# EAGLE design MainBoard (EAGLE 9.2.2)

## Sheet 1 of 2
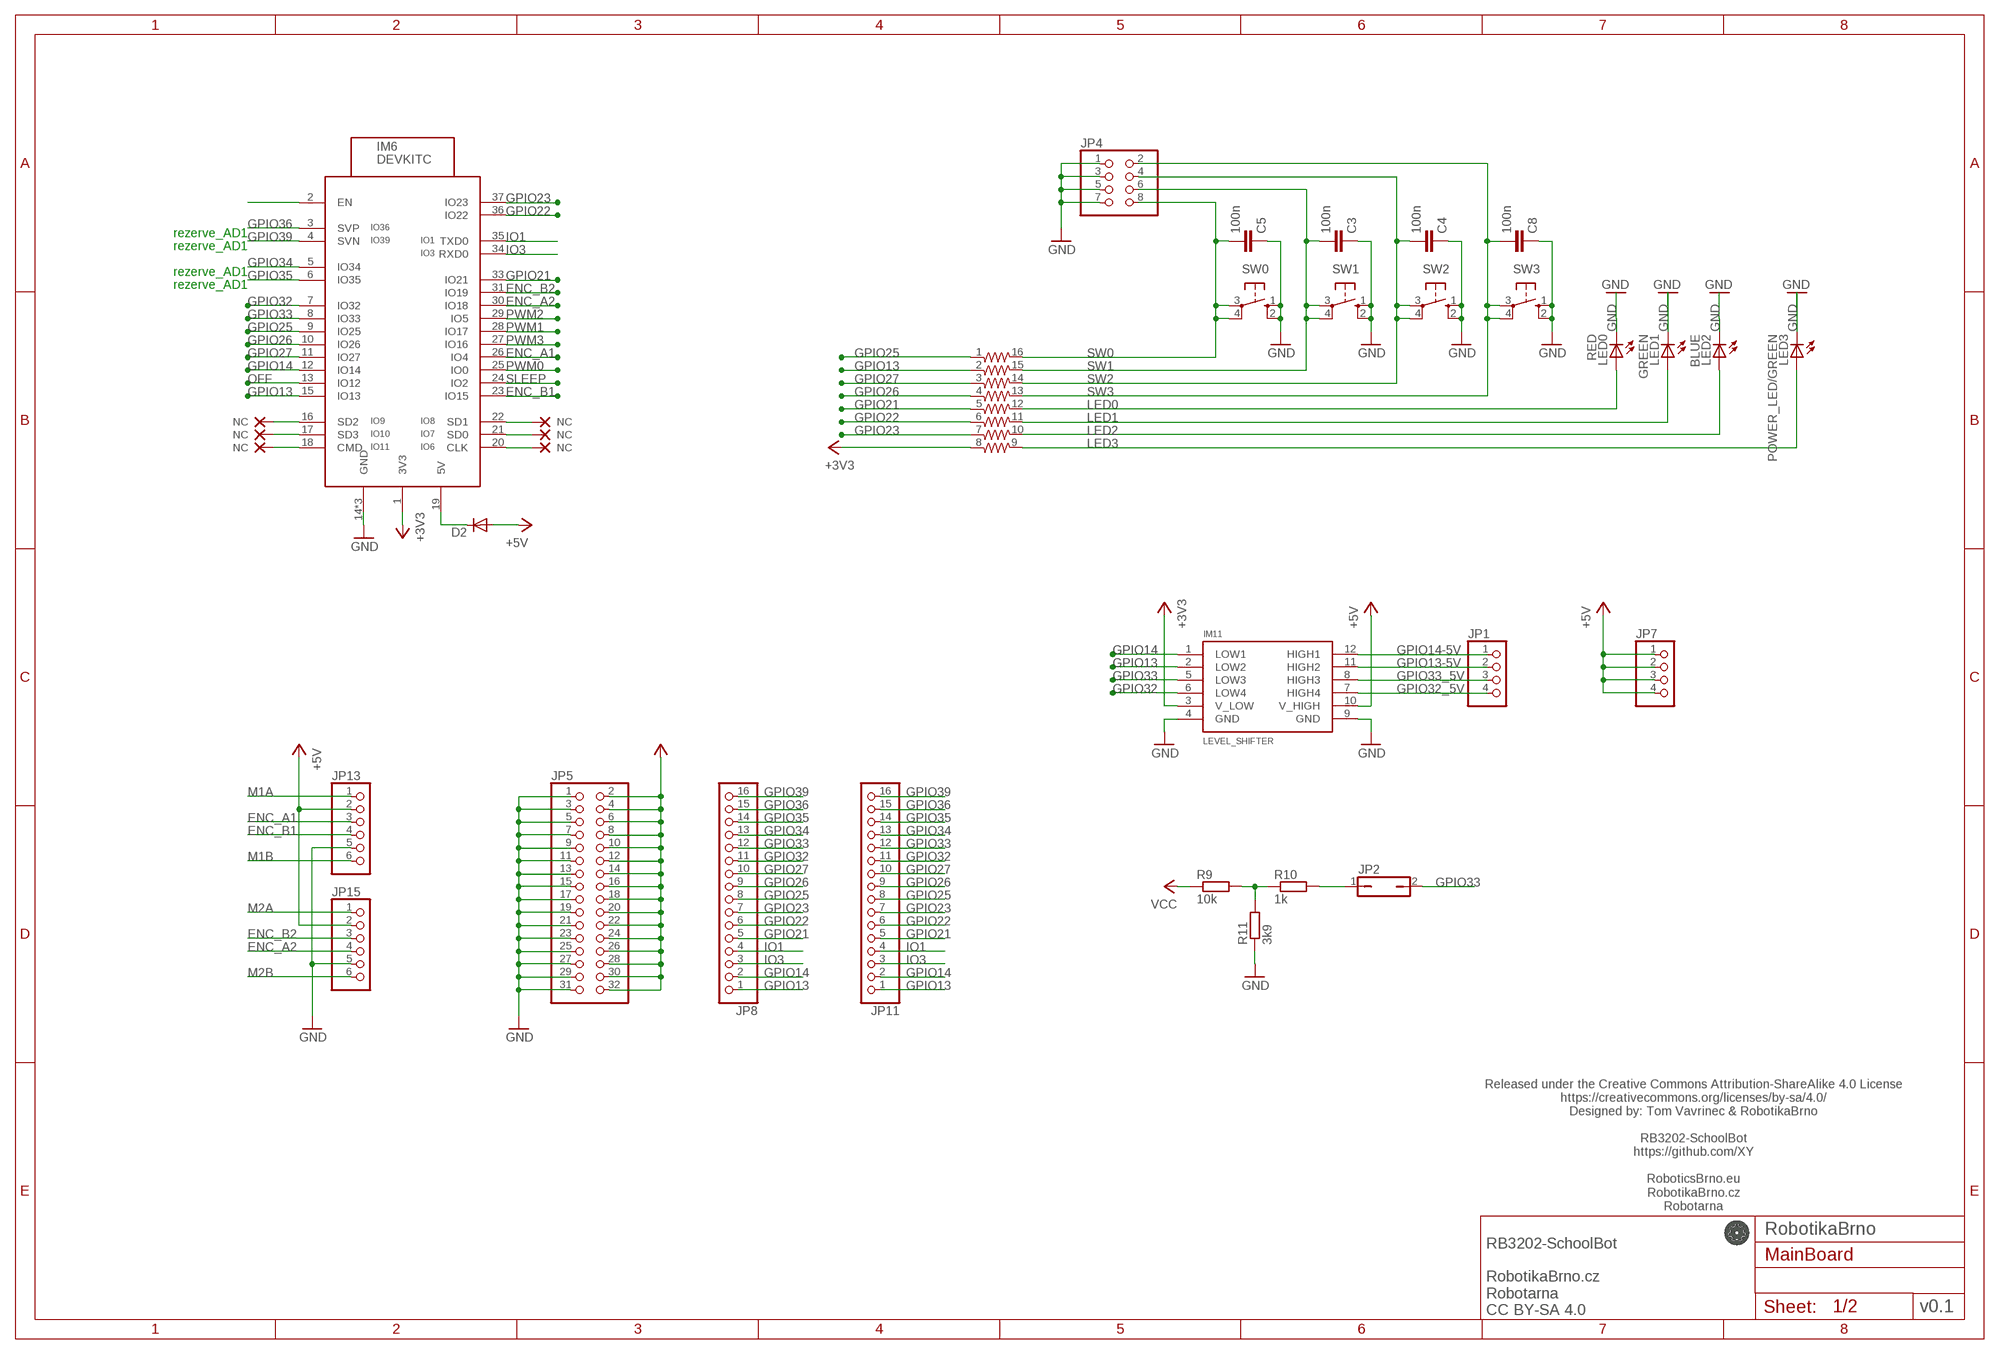
[diagram p0: schematic, sheet 1]

### Parts
C3  100n  C-EUC1206  [C1206]
C4  100n  C-EUC1206  [C1206]
C5  100n  C-EUC1206  [C1206]
C8  100n  C-EUC1206  [C1206]
D2  DIODE-D-7.5  [D-7.5]
IM6  DEVKITC  [DEVKITC]
IM11  LEVEL_SHIFTER  [LEVEL_SHIFTER]
JP1  PINHD-1X4  [1X04]
JP2  JP1Q  [JP1]
JP4  PINHD-2X4  [2X04]
JP5  PINHD-2X16  [2X16]
JP7  PINHD-1X4/90  [1X04/90]
JP8  PINHD-1X16  [1X16]
JP11  PINHD-1X16  [1X16]
JP13  PINHD-1X6  [1X06]
JP15  PINHD-1X6  [1X06]
LED0  RED  LED3MM  [LED3MM]
LED1  GREEN  LED3MM  [LED3MM]
LED2  BLUE  LED3MM  [LED3MM]
LED3  POWER_LED/GREEN  LED3MM  [LED3MM]
NC1  NC  (no package)
NC2  NC  (no package)
NC3  NC  (no package)
NC4  NC  (no package)
NC5  NC  (no package)
NC6  NC  (no package)
R9  10k  R-EU_M0805  [M0805]
R10  1k  R-EU_M0805  [M0805]
R11  3k9  R-EU_M0805  [M0805]
RN1  741-16_SNS  [742-16NS]
SW0  10-XX  [B3F-10XX]
SW1  10-XX  [B3F-10XX]
SW2  10-XX  [B3F-10XX]
SW3  10-XX  [B3F-10XX]

### Nets
+3V3: IM6.1(3V3) IM11.3(V_LOW) JP5.2 JP5.4 JP5.6 JP5.8 JP5.10 JP5.12 JP5.14 JP5.16 JP5.18 JP5.20 JP5.22 JP5.24 JP5.26 JP5.28 JP5.30 JP5.32 RN1.8 ; also sheet 2
+5V: D2.A IM11.10(V_HIGH) JP7.1 JP7.2 JP7.3 JP7.4 JP13.2 JP15.2 ; also sheet 2
+5V_ESP: D2.C IM6.19(5V)
ENC_A1: IM6.26(IO4) JP13.3
ENC_A2: IM6.30(IO18) JP15.4
ENC_B1: IM6.23(IO15) JP13.4
ENC_B2: IM6.31(IO19) JP15.3
GND: C3.1 C4.1 C5.1 C8.1 IM6.14(GND) IM6.32(GND) IM6.38(GND) IM11.4(GND) IM11.9(GND) JP4.1 JP4.3 JP4.5 JP4.7 JP5.1 JP5.3 JP5.5 JP5.7 JP5.9 JP5.11 JP5.13 JP5.15 JP5.17 JP5.19 JP5.21 JP5.23 JP5.25 JP5.27 JP5.29 JP5.31 JP13.5 JP15.5 LED0.K(C) LED1.K(C) LED2.K(C) LED3.K(C) R11.1 SW0.1(S) SW0.2(S1) SW1.1(S) SW1.2(S1) SW2.1(S) SW2.2(S1) SW3.1(S) SW3.2(S1) ; also sheet 2
GPIO13: IM6.15(IO13) IM11.2(LOW2) JP8.1 JP11.1 RN1.2
GPIO13-5V: IM11.11(HIGH2) JP1.2
GPIO14: IM6.12(IO14) IM11.1(LOW1) JP8.2 JP11.2
GPIO14-5V: IM11.12(HIGH1) JP1.1 ; also sheet 2
GPIO21: IM6.33(IO21) JP8.5 JP11.5 RN1.5
GPIO22: IM6.36(IO22) JP8.6 JP11.6 RN1.6
GPIO23: IM6.37(IO23) JP8.7 JP11.7 RN1.7 ; also sheet 2
GPIO25: IM6.9(IO25) JP8.8 JP11.8 RN1.1
GPIO26: IM6.10(IO26) JP8.9 JP11.9 RN1.4
GPIO27: IM6.11(IO27) JP8.10 JP11.10 RN1.3
GPIO32: IM6.7(IO32) IM11.6(LOW4) JP8.11 JP11.11
GPIO32_5V: IM11.7(HIGH4) JP1.4
GPIO33: IM6.8(IO33) IM11.5(LOW3) JP2.2 JP8.12 JP11.12
GPIO33_5V: IM11.8(HIGH3) JP1.3
GPIO34: IM6.5(IO34) JP8.13 JP11.13
GPIO35: IM6.6(IO35) JP8.14 JP11.14
GPIO36: IM6.3(SVP) JP8.15 JP11.15
GPIO39: IM6.4(SVN) JP8.16 JP11.16
IO1: IM6.35(TXD0) JP8.4 JP11.4
IO3: IM6.34(RXD0) JP8.3 JP11.3
IO9_NC: IM6.16(SD2) NC1.NC
IO9_NC1: IM6.20(CLK) NC4.NC
IO10_NC: IM6.17(SD3) NC2.NC
IO10_NC1: IM6.21(SD0) NC5.NC
IO11_NC: IM6.18(CMD) NC3.NC
IO11_NC1: IM6.22(SD1) NC6.NC
LED0: LED0.A RN1.12
LED1: LED1.A RN1.11
LED2: LED2.A RN1.10
LED3: LED3.A RN1.9
M1A: JP13.1 ; also sheet 2
M1B: JP13.6 ; also sheet 2
M2A: JP15.1 ; also sheet 2
M2B: JP15.6 ; also sheet 2
N$2: JP2.1 R10.2
N$4: R9.2 R10.1 R11.2
N$6: IM6.2(EN)
OFF: IM6.13(IO12) ; also sheet 2
PWM0: IM6.25(IO0) ; also sheet 2
PWM1: IM6.28(IO17) ; also sheet 2
PWM2: IM6.29(IO5) ; also sheet 2
PWM3: IM6.27(IO16) ; also sheet 2
SLEEP: IM6.24(IO2) ; also sheet 2
SW0: C5.2 JP4.8 RN1.16 SW0.3(P) SW0.4(P1)
SW1: C3.2 JP4.6 RN1.15 SW1.3(P) SW1.4(P1)
SW2: C4.2 JP4.4 RN1.14 SW2.3(P) SW2.4(P1)
SW3: C8.2 JP4.2 RN1.13 SW3.3(P) SW3.4(P1)
VCC: R9.1 ; also sheet 2

### Notes on the sheet
- rezerve_AD1
- rezerve_AD1
- rezerve_AD1
- rezerve_AD1
- Released under the Creative Commons Attribution-ShareAlike 4.0 License
  https://creativecommons.org/licenses/by-sa/4.0/
  Designed by: Tom Vavrinec & RobotikaBrno
  
  RB3202-SchoolBot
  https://github.com/XY
  
  RoboticsBrno.eu
  RobotikaBrno.cz
  Robotarna
- RobotikaBrno
- v0.1
- RB3202-SchoolBot
  
  RobotikaBrno.cz
  Robotarna
  CC BY-SA 4.0

## Sheet 2 of 2
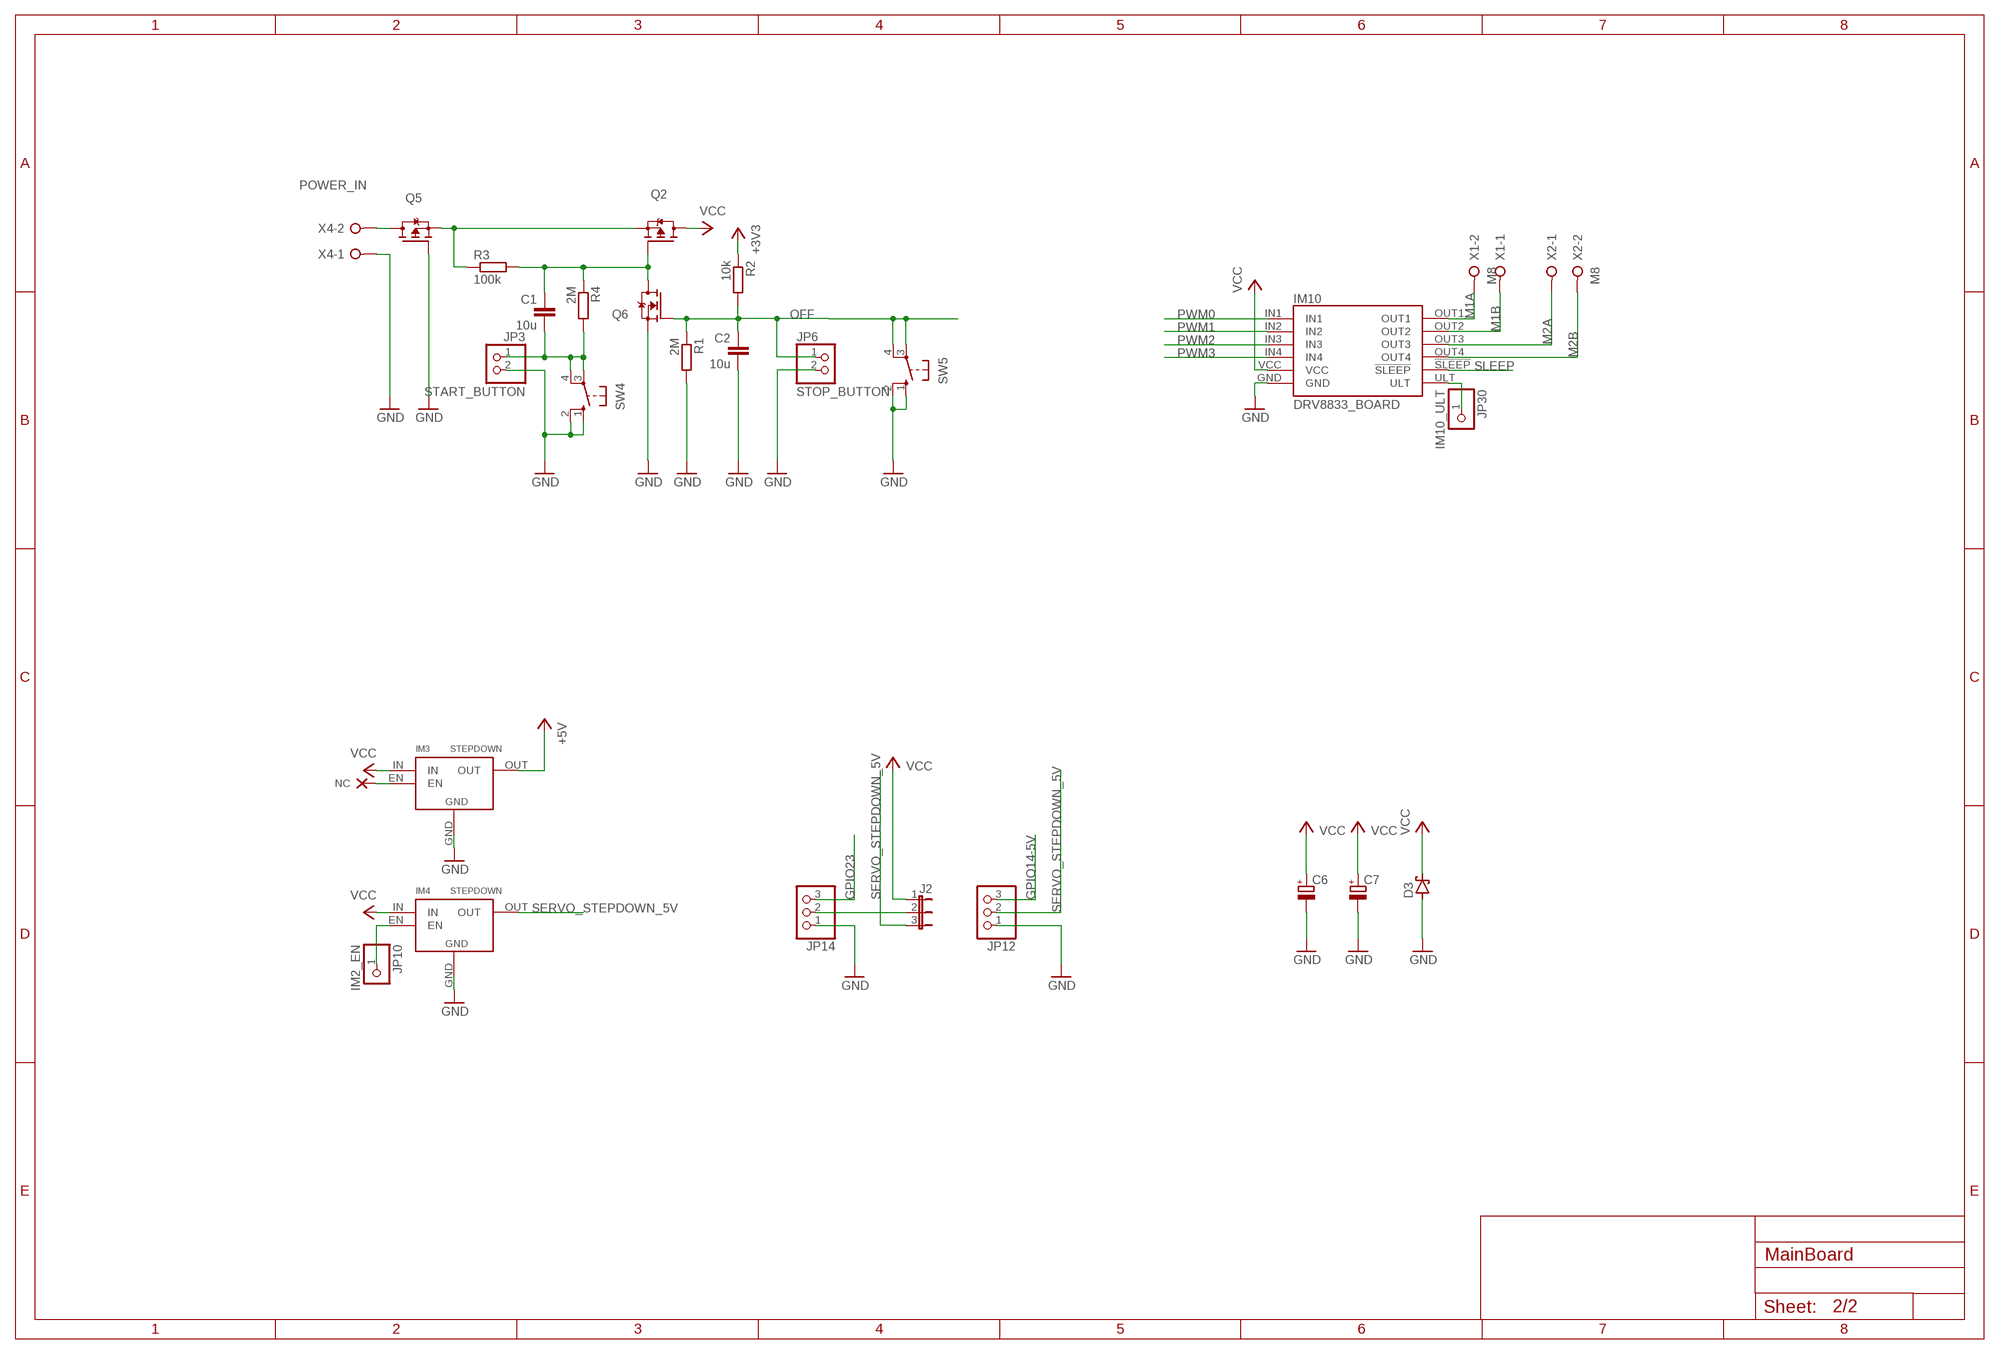
[diagram p1: schematic, sheet 2]

### Parts
C1  10u  C-EUC1206  [C1206]
C2  10u  C-EUC1206  [C1206]
C6  CPOL-EUE5-10.5  [E5-10,5]
C7  CPOL-EUE5-10.5  [E5-10,5]
D3  SCHOTTKY-DIODEF126Z12  [F126Z12]
IM3  STEPDOWN  [STEPDOWN]
IM4  STEPDOWN  [STEPDOWN]
IM10  DRV8833_BOARD  [PINHEAD]
J2  JP2E  [JP2]
JP3  START_BUTTON  PINHD-1X2  [1X02]
JP6  STOP_BUTTON  PINHD-1X2  [1X02]
JP10  IM2_EN  PINHD-1X1  [1X01]
JP12  PINHD-1X3  [1X03]
JP14  PINHD-1X3  [1X03]
JP30  IM10_ULT  PINHD-1X1  [1X01]
NC7  NC  (no package)
Q2  P-MOSFET-TO220V  [TO220V]
Q5  P-MOSFET-TO220V  [TO220V]
Q6  N-MOSFET-SOT23-GSD  [SOT23]
R1  2M  R-EU_R0805  [R0805]
R2  10k  R-EU_0204/2V  [0204V]
R3  100k  R-EU_R0805  [R0805]
R4  2M  R-EU_M0805  [M0805]
SW4  10-XX  [B3F-10XX]
SW5  10-XX  [B3F-10XX]
X1  M8  W237-02P  [W237-132]
X2  M8  W237-02P  [W237-132]
X4  POWER_IN  W237-02P  [W237-132]

### Nets
+3V3: R2.1 ; also sheet 1
+5V: IM3.OUT ; also sheet 1
BAT1: Q5.2(D) X4.2
BAT_PROT1: Q2.3(S) Q5.3(S) R3.1
GND: C2.2 C6.- C7.- D3.A IM3.GND IM4.GND IM10.GND JP3.2 JP6.2 JP12.1 JP14.1 Q5.1(G) Q6.2(S) R1.2 SW4.1(S) SW4.2(S1) SW5.1(S) SW5.2(S1) X4.1 ; also sheet 1
GPIO14-5V: JP12.3 ; also sheet 1
GPIO23: JP14.3 ; also sheet 1
IO9_NC2: IM3.EN NC7.NC
M1A: IM10.OUT1 X1.2 ; also sheet 1
M1B: IM10.OUT2 X1.1 ; also sheet 1
M2A: IM10.OUT3 X2.1 ; also sheet 1
M2B: IM10.OUT4 X2.2 ; also sheet 1
N$1: IM10.ULT JP30.1
N$3: J2.2 JP14.2
OFF: C2.1 JP6.1 Q6.1(G) R1.1 R2.2 SW5.3(P) SW5.4(P1) ; also sheet 1
PWM0: IM10.IN1 ; also sheet 1
PWM1: IM10.IN2 ; also sheet 1
PWM2: IM10.IN3 ; also sheet 1
PWM3: IM10.IN4 ; also sheet 1
SERVO_STEPDOWN_5V: IM4.OUT J2.3 JP12.2
SLEEP: IM10.!SLEEP ; also sheet 1
START_BUTTON1: C1.2 JP3.1 R4.2 SW4.3(P) SW4.4(P1)
START_GATE1: C1.1 Q2.1(G) Q6.3(D) R3.2 R4.1
STEP2_EN1: IM4.EN JP10.1
VCC: C6.+ C7.+ D3.C IM3.IN IM4.IN IM10.VCC J2.1 Q2.2(D) ; also sheet 1

## Library data of the parts
C1-C5 C8 = rcl_upravena:C-EU: CAPACITOR, European symbol
C6 C7 = rcl:CPOL-EU: POLARIZED CAPACITOR, European symbol; SPICEPREFIX: C
D2 = diode:DIODE-: DIODE
D3 = diode:SCHOTTKY-DIODE: Schottky Diode
IM3 IM4 = StepDown:STEPDOWN
IM6 = esp32:DEVKITC
IM10 = DRV8833board:DRV8833_BOARD
IM11 = LevelShifter:LEVEL_SHIFTER
J2 = jumper:JP2E: JUMPER
JP1 JP7 = pinhead:PINHD-1X4: PIN HEADER
JP2 = jumper:JP1Q: JUMPER
JP3 JP6 = pinhead:PINHD-1X2: PIN HEADER
JP4 = pinhead:PINHD-2X4: PIN HEADER
JP5 = pinhead:PINHD-2X16: PIN HEADER
JP8 JP11 = pinhead:PINHD-1X16: PIN HEADER
JP10 JP30 = pinhead:PINHD-1X1: PIN HEADER
JP12 JP14 = pinhead:PINHD-1X3: PIN HEADER
JP13 JP15 = pinhead:PINHD-1X6: PIN HEADER
LED0 LED1-LED3 = led:LED: LED OSRAM: - CHIPLED LG R971, LG N971, LY N971, LG Q971, LY Q971, LO R971, LY R971 LH N974, LH R974 LS Q976, LO Q976, LY Q976 LO Q996 - Hyper CHIPLED LW Q18S LB Q993, LB Q99A, LB R99A - SideLED LS A670, LO A670, LY A670, LG A670, LP A670 LB A673, LV A673, LT A673, LW A673 LH A674 LY A675 LS A676, LA A676, LO A676, LY A676, LW A676 LS A679, LY A679, LG A679 - Hyper Micro SIDELED® LS Y876, LA Y876, LO Y876, LY Y876 LT Y87S - SmartLED LW L88C, LW L88S LB L89C, LB L89S, LG L890 LS L89K, LO L89K, LY L89K LS L896, LA L896, LO L896, LY L896 - TOPLED LS T670, LO T670, LY T670, LG T670, LP T670 LSG T670, LSP T670, LSY T670, LOP T670, LYG T670 LG T671, LOG T671, LSG T671 LB T673, LV T673, LT T673, LW T673 LH T674 LS T676, LA T676, LO T676, LY T676, LB T676, LH T676, LSB T676, LW T676 LB T67C, LV T67C, LT T67C, LS T67K, LO T67K, LY T67K, LW E67C LS E67B, LA E67B, LO E67B, LY E67B, LB E67C, LV E67C, LT E67C LW T67C LS T679, LY T679, LG T679 LS T770, LO T770, LY T770, LG T770, LP T770 LB T773, LV T773, LT T773, LW T773 LH T774 LS E675, LA E675, LY E675, LS T675 LS T776, LA T776, LO T776, LY T776, LB T776 LHGB T686 LT T68C, LB T68C - Hyper Mini TOPLED® LB M676 - Mini TOPLED Santana® LG M470 LS M47K, LO M47K, LY M47K Source: http://www.osram.convergy.de LUXEON: - LUMILED® LXK2-PW12-R00, LXK2-PW12-S00, LXK2-PW14-U00, LXK2-PW14-V00 LXK2-PM12-R00, LXK2-PM12-S00, LXK2-PM14-U00 LXK2-PE12-Q00, LXK2-PE12-R00, LXK2-PE12-S00, LXK2-PE14-T00, LXK2-PE14-U00 LXK2-PB12-K00, LXK2-PB12-L00, LXK2-PB12-M00, LXK2-PB14-N00, LXK2-PB14-P00, LXK2-PB14-Q00 LXK2-PR12-L00, LXK2-PR12-M00, LXK2-PR14-Q00, LXK2-PR14-R00 LXK2-PD12-Q00, LXK2-PD12-R00, LXK2-PD12-S00 LXK2-PH12-R00, LXK2-PH12-S00 LXK2-PL12-P00, LXK2-PL12-Q00, LXK2-PL12-R00 Source: www.luxeon.com KINGBRIGHT: KA-3528ASYC Source: www.kingbright.com
NC1-NC7 = NC:NC: _EXTERNAL_
Q2 Q5 = transistors:P-MOSFET
Q6 = transistors:N-MOSFET
R1-R4 = rcl_upravena:R-EU_: RESISTOR, European symbol
R9-R11 = resistor:R-EU_: RESISTOR, European symbol
RN1 = resistor-array:741-16_S: CTS 741 Series 16 Terminations, 8 Resistors
SW0 SW1-SW5 = switch-omron:10-XX: OMRON SWITCH; MPN: B3F-1000; OC_FARNELL: 176432; OC_NEWARK: 36M3542
X1 X2 X4 = con-wago-508:W237-02P: WAGO SREW CLAMP; OC_FARNELL: unknown; OC_NEWARK: unknown

## Net classes
0 default: width 0.2 mm, drill 0.35 mm, clearance 0.2 mm

## Board
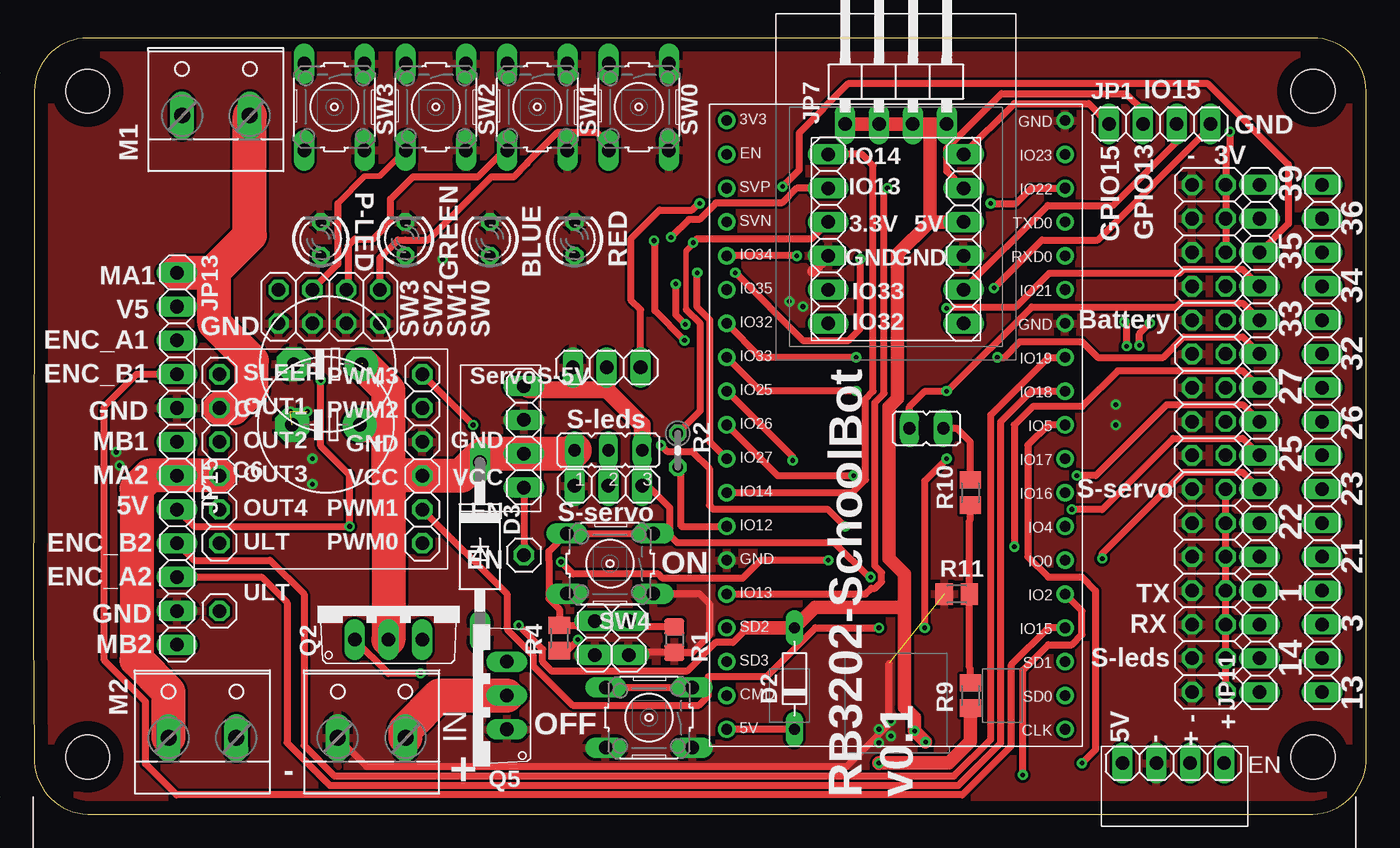
[diagram p2: board, top side]
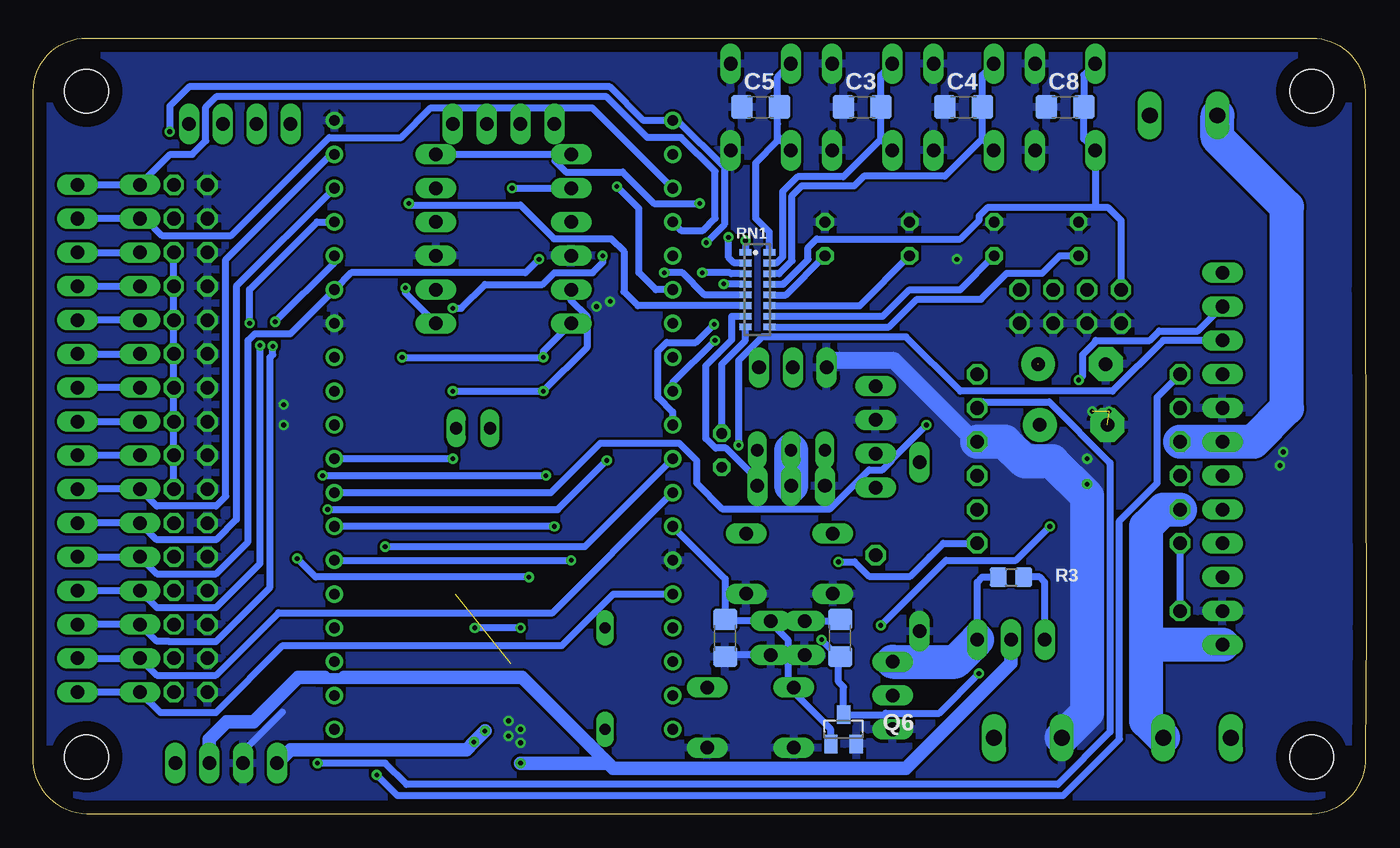
[diagram p3: board, bottom side, seen from below]

Size 100.08 x 58.3 mm. Coordinates in mm from the lower left corner, seen from the top.
Outline: 4.08,58.3 arc90 0.08,54.3 0.08,39.4 0,14 0.08,4.3 arc90 4.08,0 96.08,0 arc90 100.08,4.3 100.08,54.3 arc90 96.08,58.3 4.08,58.3
Copper layers (1*16): Top 0.035mm / dielectric 1.5mm / Bottom 0.035mm
Design rules "gatema_2layers *": minimum track width 6mil, minimum drill 0.35mm, track to track 6mil, track to pad 6mil, pad to pad 6mil, via to via 6mil, smd to smd 6mil, copper to edge 40mil, drill to drill 6mil, minimum pad ring 10mil, minimum via ring 8mil, stop-mask expansion 4mil, vias tented up to drill 0mil, thermal gap 10mil
Holes 3.3 mm at 4.08,54.3 4.08,4.3 96.08,4.3 96.08,54.3
tRestrict: area 93.6,1.8 to 98.6,6.8; area 1.6,1.8 to 6.6,6.8; area 1.6,51.8 to 6.6,56.8; area 93.6,51.8 to 98.6,56.8

### Footprints (pad centres in the part's own frame; a part is rotated, then mirrored left to right if it is on the bottom)
C1206 = smd 1.6 x 1.8: 1 -1.4,0; 2 1.4,0
E5-10,5 = drill 1.016 pad 2.54: + -2.54,0 | drill 1.016 pad 2.54 octagon: - 2.54,0
D-7.5 = drill 0.813 long: A 3.81,0; C -3.81,0
F126Z12 = drill 1.016 long: A 6.35,0; C -6.35,0
STEPDOWN = drill 1.016 long: EN 1.27,8.89; GND 1.27,3.81; IN 1.27,6.35; OUT 1.27,1.27
DEVKITC = drill 0.8: 1 -12.7,46.99; 2 -12.7,44.45; 3 -12.7,41.91; 4 -12.7,39.37; 5 -12.7,36.83; 6 -12.7,34.29; 7 -12.7,31.75; 8 -12.7,29.21; 9 -12.7,26.67; 10 -12.7,24.13; 11 -12.7,21.59; 12 -12.7,19.05; 13 -12.7,16.51; 14 -12.7,13.97; 15 -12.7,11.43; 16 -12.7,8.89; 17 -12.7,6.35; 18 -12.7,3.81; 19 -12.7,1.27; 20 12.7,1.27; 21 12.7,3.81; 22 12.7,6.35; 23 12.7,8.89; 24 12.7,11.43; 25 12.7,13.97; 26 12.7,16.51; 27 12.7,19.05; 28 12.7,21.59; 29 12.7,24.13; 30 12.7,26.67; 31 12.7,29.21; 32 12.7,31.75; 33 12.7,34.29; 34 12.7,36.83; 35 12.7,39.37; 36 12.7,41.91; 37 12.7,44.45; 38 12.7,46.99
PINHEAD = drill 1.016 octagon: !SLEEP 1.27,13.97; GND 16.51,8.89; IN1 16.51,1.27; IN2 16.51,3.81; IN3 16.51,11.43; IN4 16.51,13.97; OUT1 1.27,11.43; OUT2 1.27,8.89; OUT3 1.27,6.35; OUT4 1.27,3.81; ULT 1.27,1.27; VCC 16.51,6.35
LEVEL_SHIFTER = drill 1.016 long: 1 1.27,1.27; 2 3.81,1.27; 3 6.35,1.27; 4 8.89,1.27; 5 11.43,1.27; 6 13.97,1.27; 7 13.97,11.43; 8 11.43,11.43; 9 8.89,11.43; 10 6.35,11.43; 11 3.81,11.43; 12 1.27,11.43
JP2 = drill 0.914 long: 1 -2.54,0; 2 0,0; 3 2.54,0
1X04 = drill 1.016 long: 1 -3.81,0; 2 -1.27,0; 3 1.27,0; 4 3.81,0
JP1 = drill 0.914 long: 1 0,-1.27; 2 0,1.27
1X02 = drill 1.016 long: 1 -1.27,0; 2 1.27,0
2X04 = drill 1.016 octagon: 1 -3.81,-1.27; 2 -3.81,1.27; 3 -1.27,-1.27; 4 -1.27,1.27; 5 1.27,-1.27; 6 1.27,1.27; 7 3.81,-1.27; 8 3.81,1.27
2X16 = drill 1.016 octagon: 1 -19.05,-1.27; 2 -19.05,1.27; 3 -16.51,-1.27; 4 -16.51,1.27; 5 -13.97,-1.27; 6 -13.97,1.27; 7 -11.43,-1.27; 8 -11.43,1.27; 9 -8.89,-1.27; 10 -8.89,1.27; 11 -6.35,-1.27; 12 -6.35,1.27; 13 -3.81,-1.27; 14 -3.81,1.27; 15 -1.27,-1.27; 16 -1.27,1.27; 17 1.27,-1.27; 18 1.27,1.27; 19 3.81,-1.27; 20 3.81,1.27; 21 6.35,-1.27; 22 6.35,1.27; 23 8.89,-1.27; 24 8.89,1.27; 25 11.43,-1.27; 26 11.43,1.27; 27 13.97,-1.27; 28 13.97,1.27; 29 16.51,-1.27; 30 16.51,1.27; 31 19.05,-1.27; 32 19.05,1.27
1X04/90 = drill 1.016 long: 1 -3.81,-3.81; 2 -1.27,-3.81; 3 1.27,-3.81; 4 3.81,-3.81
1X16 = drill 1.016 long: 1 -19.05,0; 2 -16.51,0; 3 -13.97,0; 4 -11.43,0; 5 -8.89,0; 6 -6.35,0; 7 -3.81,0; 8 -1.27,0; 9 1.27,0; 10 3.81,0; 11 6.35,0; 12 8.89,0; 13 11.43,0; 14 13.97,0; 15 16.51,0; 16 19.05,0
1X01 = drill 1.016 octagon: 1 0,0
1X03 = drill 1.016 long: 1 -2.54,0; 2 0,0; 3 2.54,0
1X06 = drill 1.016 long: 1 -6.35,0; 2 -3.81,0; 3 -1.27,0; 4 1.27,0; 5 3.81,0; 6 6.35,0
LED3MM = drill 0.813 octagon: A -1.27,0; K 1.27,0
TO220V = drill 1.016 long: 1 -2.54,-2.54; 2 0,-2.54; 3 2.54,-2.54
SOT23 = smd 1 x 1.4: 1 -0.95,-1.1; 2 0.95,-1.1; 3 0,1.1
R0805 = smd 1.3 x 1.5: 1 -0.95,0; 2 0.95,0
0204V = drill 0.813 octagon: 1 -1.27,0; 2 1.27,0
M0805 = smd 1.3 x 1.6: 1 -0.95,0; 2 0.95,0
742-16NS = smd 0.5 x 0.9: 1 -2.8,-0.9; 2 -2,-0.9; 3 -1.2,-0.9; 4 -0.4,-0.9; 5 0.4,-0.9; 6 1.2,-0.9; 7 2,-0.9; 8 2.8,-0.9; 9 2.8,0.9; 10 2,0.9; 11 1.2,0.9; 12 0.4,0.9; 13 -0.4,0.9; 14 -1.2,0.9; 15 -2,0.9; 16 -2.8,0.9
B3F-10XX = drill 1.016 long: 1 -3.251,2.261; 2 3.251,2.261; 3 -3.251,-2.261; 4 3.251,-2.261
W237-132 = drill 1.194 long: 1 -2.54,-0.635; 2 2.54,-0.635

### Placement (x,y rotation side)
C1  39.5,13.24 90 bottom
C2  48.13,13.24 270 bottom
C3  37.85,53.12 0 bottom
C4  30.23,53.12 0 bottom
C5  45.47,53.12 0 bottom
C6  21.97,29.24 180 top
C7  22.1,33.81 180 top
C8  22.61,53.12 0 bottom
D2  57.15,10.19 90 top
D3  33.53,20.1 270 top
IM3  80.52,5.11 270 top
IM4  38.1,33.43 180 top
IM6  64.77,5.11 0 top
IM10  12.7,19.08 0 top
IM11  58.42,50.83 270 top
J2  43.18,27.34 0 top
JP1  84.58,51.85 0 top
JP2  67.06,28.99 90 top
JP3  42.16,13.24 270 top
JP4  22.23,38.13 0 top
JP5  88.27,28.22 270 top
JP6  44.7,13.24 270 top
JP7  64.77,55.66 0 top
JP8  96.77,28.22 90 top
JP10  36.83,19.46 0 top
JP11  92.08,28.22 90 top
JP12  43.05,33.56 0 top
JP13  10.79,34.32 270 top
JP14  43.18,24.67 0 top
JP15  10.79,19.08 270 top
JP30  13.97,15.27 0 top
LED0  40.64,43.21 90 top
LED1  34.29,43.21 90 top
LED2  27.94,43.21 90 top
LED3  21.59,43.21 90 top
Q2  26.67,15.65 0 top
Q5  33.02,8.92 90 top
Q6  39.24,6.38 0 bottom
R1  48.13,13.11 270 top
R2  48.39,27.34 270 top
R3  26.67,17.81 0 bottom
R4  39.5,13.24 90 top
R9  70.36,8.92 90 top
R10  70.36,24.16 90 top
R11  69.34,16.54 0 top
RN1  45.72,39.4 270 bottom
SW0  45.47,53.12 270 top
SW1  37.85,53.12 270 top
SW2  30.23,53.12 270 top
SW3  22.61,53.12 270 top
SW4  43.31,18.83 180 top
SW5  46.23,7.27 180 top
X1  13.72,53.12 0 top
X2  12.7,6.38 0 top
X4  25.4,6.38 0 top

### Tracks (layer width: path | path; a pad name or v marks a point on that pad's centre or on a via)
+3V3  (via drill 0.35)
  Top 0.406: 49.02,37.9 49.02,42.28 49.55,42.81 v49.55,42.94
  Top 0.508: IM11.3 58.42,43.21 49.82,43.21 v49.55,42.94 | R2.1 50.09,30.31 50.09,36.83 49.02,37.9 | JP5.32 JP5.30 JP5.28 JP5.26 JP5.24 JP5.22 JP5.20 | JP5.6 JP5.4 JP5.2 89.53,49.81 89.84,50.12 v89.84,51.26
  Bottom 0.508: R2.1 48.39,33.81 46.62,35.58 RN1.8 | JP5.20 JP5.18 | JP5.20 JP5.16 | JP5.20 JP5.14 | JP5.20 JP5.12 | JP5.20 JP5.10 | JP5.20 JP5.8 | JP5.20 JP5.6 | v89.84,51.26 89.84,53.19 88.39,54.64 56.78,54.64 54.24,52.1 IM6.1 51.7,52.1 48.19,48.58 48.19,44.3 v49.55,42.94
+5V  (via drill 0.35)
  Top 0.508: JP15.2 12.07,21.62 v23.75,21.62 23.75,25.5 21.59,27.66 v21.59,32.61 | 53.64,14 52.53,12.89 51.22,12.89 49.08,10.75 38.94,10.75 38.24,11.45 38.24,12.39 v36.45,14.19
  Top 1.016: 67.31,44.48 64.9,42.07 64.9,31.23 64.26,30.6 64.26,19.21 65.41,18.06 65.41,15.52 | IM11.10 67.31,44.48 | 65.41,15.52 65.41,8.03 66.17,7.27 v66.17,6.25 v66.99,5.43 | 53.64,14 D2.A 58.67,15.52 65.41,15.52 | 67.31,44.48 67.31,51.85 | 67.31,51.85 JP7.3 JP7.2 JP7.1 | JP7.4 67.31,51.85
  Bottom 0.508: v36.45,14.19 31.56,19.08 26.29,19.08 v23.75,21.62 | JP13.2 12.63,36.3 15.53,36.3 16.25,35.58 20.33,35.58 20.33,35.48 21.28,34.53 21.28,32.92 v21.59,32.61
  Bottom 1.016: IM3.OUT 80.77,4.86 67.56,4.86 v66.99,5.43 v66.17,6.25
+5V_ESP
  Top 0.508: D2.C IM6.19
BAT1
  Top 2.54: X4.2 27.94,6.38 30.48,8.92 Q5.2
BAT_PROT1
  Bottom 0.508: Q2.3 29.21,17.43 28.83,17.81 R3.1
  Bottom 2.54: Q5.3 30.86,11.46 Q2.3
ENC_A1  (via drill 0.35)
  Top 0.508: v60.96,21.62 60.93,21.62 59.62,22.93 51.05,22.93 50.76,23.21 50.76,25.95 49.46,27.25 47.58,27.25 v47.12,27.72
  Bottom 0.508: JP13.3 15.24,35.59 19.05,31.78 30.48,31.78 34.54,35.84 45.35,35.84 47.12,34.08 v47.12,27.72 | v60.96,21.62 IM6.26
ENC_A2
  Top 0.508: IM6.30 74.93,31.78 72.64,29.49 72.64,5.36 69.45,2.17 22.26,2.17 19.05,5.38 19.05,15.91 17.14,17.81 JP15.4
ENC_B1
  Top 0.508: IM6.23 76.2,14 73.41,11.21 73.41,5.11 69.76,1.46 10.76,1.46 8.43,3.79 8.43,8.46 5.33,11.56 5.33,30.64 7.75,33.05 JP13.4
ENC_B2
  Top 0.508: IM6.31 76.2,34.32 71.88,30 71.88,5.62 69.14,2.88 22.61,2.88 20.32,5.16 20.32,16.54 17.78,19.08 12.07,19.08 JP15.3
GND  (via drill 0.35)  (3 unrouted)
  Top 0.508: R1.2 44.9,12.16 JP6.2 JP3.2 | R1.2 48.58,12.16 | R1.2 49.48,12.16 50.8,13.48 50.8,15.78 50.01,16.57 SW4.1 | X4.1 25.02,3.59 61.09,3.59 64.26,6.76 64.26,11.33
  Top 0.813: IM11.4 58.52,40.77
  Bottom 0.508: JP6.2 48,11.97 C2.2 | IM3.GND 84.33,4.73 81.37,7.69
  Bottom 1.27: 29.35,27.97 35.45,34.07 40,34.07 JP12.1
  Bottom 2.54: X4.1 20.95,7.65 20.95,23.91 23.55,26.5 25.65,26.5 27.12,27.97 IM10.GND
  other vias: 20.95,26.7 20.95,24.8 56.77,38.51 57.78,38.13 81.28,29.24 81.28,30.76 20.57,30.26 19.3,30.26 6.48,26.19 6.22,27.21 30.73,41.69 64.39,7.01 64.39,5.87 63.5,6.38 63.5,5.36
  pour Top: -2.54,59.72 101.6,59.72 101.6,-1.24 -2.54,-1.24
  pour Bottom: -5.08,62.26 -5.08,-3.78 104.14,-3.78 104.14,62.26
GPIO13  (via drill 0.35)
  Top 0.508: v64.14,47.02 63.88,46.77 63.88,31.6 63.19,30.91 63.19,18.66 63.7,18.16 63.7,17.46 63.21,16.98 62.92,16.98 62.48,16.54 IM6.15 | v47.88,43.34 49.22,44.68 50.01,44.68 51.25,45.91 56.2,45.91 57.31,47.02 IM11.2
  Bottom 0.508: IM6.15 56.52,16.54 60.39,12.67 81.34,12.67 86.36,7.65 90.55,7.65 JP11.1 JP8.1 | v64.14,47.02 IM11.2 | RN1.2 47.47,41.4 47.88,41.81 v47.88,43.34
GPIO13-5V
  Top 0.508: JP1.2 83.31,52.86 82.04,54.13 72.7,54.13 68.58,50.01 68.58,48.29 IM11.11
GPIO14
  Top 0.508: IM11.1 62.23,49.56 63.06,48.73 63.06,31.78 62.48,31.21 62.48,25.14 61.5,24.16 IM6.12
  Bottom 0.508: IM6.12 61.09,15.14 81.66,15.14 86.36,10.44 90.8,10.44 JP11.2 JP8.2
GPIO14-5V  (via drill 0.35)
  Top 0.508: JP12.3 45.59,37.89 44.89,38.59 44.89,43.24 47.03,45.38 49.45,45.38 49.95,45.88 v50.04,45.88 | IM11.12 73.66,53.37 79.25,53.37 JP1.1
  Bottom 0.508: v50.04,45.88 53.47,45.88 55.83,48.24 60.09,48.24 60.91,49.06 60.91,49.51 60.96,49.56 IM11.12
GPIO21  (via drill 0.35)
  Top 0.508: v52.7,40.67 57.78,35.59 61.21,35.59 62.1,36.48 v62.1,41.69
  Bottom 0.508: RN1.5 49.67,39 51.34,40.67 v52.7,40.67 | JP8.5 JP11.5 90.8,18.06 86.36,18.06 83.96,20.47 83.96,35.58 83.44,36.1 80.77,36.1 IM6.33 76.2,40.67 63.12,40.67 v62.1,41.69
GPIO22  (via drill 0.35)
  Top 0.508: v71.88,45.88 73.79,45.88 74.93,47.02 IM6.36
  Bottom 0.508: IM6.36 84.84,39.65 84.84,22.13 86.36,20.6 90.8,20.6 JP11.6 JP8.6 | RN1.6 54.68,38.2 55.73,39.25 55.73,42.28 56.68,43.23 60.98,43.23 63.5,45.75 71.75,45.75 v71.88,45.88
GPIO23  (via drill 0.35)
  Top 0.508: v62.86,17.81 62.74,17.81 60.16,20.39 48.36,20.39 47.81,20.95 47.81,23.02 46.16,24.67 JP14.3 | v80.26,19.21 80.26,19.59 86.36,25.68 90.8,25.68 JP11.7
  Bottom 0.508: RN1.7 47.62,37.4 47.62,35.63 49.57,33.68 49.57,28.22 48.85,27.49 48.07,27.49 45.91,25.33 45.91,24.86 JP14.3 | v62.86,17.81 78.87,17.81 v80.26,19.21 | IM6.37 77.72,49.56 85.63,41.66 85.63,23.88 86.36,23.14 90.8,23.14 JP11.7 JP8.7
GPIO25  (via drill 0.35)
  Top 0.508: JP11.8 90.8,28.22 85.6,28.22 80.26,22.89 v77.98,22.89 | v48.89,35.59 46.67,37.81 46.67,43.02 v46.61,43.08 | IM6.9 57.02,26.83 v57.02,26.57
  Bottom 0.508: v77.98,22.89 60.71,22.89 v57.02,26.57 | JP11.8 JP8.8 | v48.89,35.59 52.07,32.41 IM6.9 | v46.61,43.08 46.61,42.21 RN1.1
GPIO26  (via drill 0.35)
  Top 0.508: v78.36,25.43 79.77,25.43 85.11,30.76 90.8,30.76 JP11.9 | v61.59,25.43 55.88,25.43 IM6.10 | v48.96,36.79 48.24,37.51 v48.24,39.83
  Bottom 0.508: v78.36,25.43 v61.59,25.43 | JP8.9 JP11.9 | v48.96,36.79 50.32,35.43 52.53,35.43 53.18,34.78 53.18,31.32 52.07,30.21 IM6.10 | RN1.4 48.21,39.8 v48.24,39.83
GPIO27  (via drill 0.35)
  Top 0.508: IM6.11 50.8,27.97 50.8,37.13 49.85,38.08 v49.85,40.67 | v73.66,20.1 73.66,29.24 75.03,30.62 78.74,30.62 81.43,33.3 90.8,33.3 JP11.10
  Bottom 0.508: IM6.11 58.67,20.1 v73.66,20.1 | JP11.10 JP8.10 | RN1.3 47.68,40.6 47.75,40.67 v49.85,40.67
GPIO32  (via drill 0.35)
  Top 0.508: v72.39,34.32 72.9,34.32 74.08,35.5 78.74,35.5 79.33,34.91 | v61.79,34.32 54.61,34.32 IM6.7 | JP11.11 90.8,35.84 86.36,35.84 84.84,34.32 79.92,34.32 | 79.33,34.91 79.92,34.32 | 79.33,34.91 79.92,34.32
  Bottom 0.508: v72.39,34.32 v61.79,34.32 61.79,34.76 IM11.6 | JP8.11 JP11.11
GPIO32_5V  (via drill 0.35)
  Top 0.508: v72.14,39.53 75.73,43.12 79.92,43.12 88.39,51.59 JP1.4
  Bottom 0.508: IM11.7 72.14,39.15 v72.14,39.53
GPIO33  (via drill 0.35)
  Top 0.508: v61.79,31.78 54.61,31.78 IM6.8 | JP11.12 90.8,38.38 86.11,38.38 85.82,38.1 74.96,38.1 68.65,31.78 v68.58,31.78 66.95,31.78 65.79,30.61 JP2.2
  Bottom 0.508: v68.58,31.78 v61.79,31.78 58.47,35.09 58.47,37.36 59.69,38.58 IM11.5 | JP11.12 JP8.12
GPIO33_5V
  Top 0.508: IM11.8 76.16,45.71 78.74,45.71 81.06,45.71 85.85,50.51 JP1.3
GPIO34  (via drill 0.35)
  Top 0.508: v57.32,41.94 IM6.5 | JP11.13 90.8,40.92 86.36,40.92 86.04,40.61 76.26,40.61 73.76,38.11 68.58,38.11 v68.58,38
  Bottom 0.508: JP8.13 JP11.13 | v57.32,41.94 57.32,41.43 58.09,40.67 60.96,40.67 61.85,39.78 66.17,39.78 67.95,38 v68.58,38
GPIO35  (via drill 0.35)
  Top 0.508: JP11.14 94.23,44.35 94.23,48.8 88.14,54.89 61.21,54.89 57.51,51.19 57.51,48.39 v56.26,47.15
  Bottom 0.508: IM6.6 53.34,39.4 54.61,40.67 54.61,45.5 v56.26,47.15 | JP8.14 JP11.14
GPIO36
  Bottom 0.508: IM6.3 58.11,53.06 70.23,53.06 72.46,50.83 77.85,50.83 85.22,43.46 90.42,43.46 91.69,44.73 JP11.15 JP8.15
GPIO39
  Bottom 0.508: IM6.4 51.43,43.84 49.81,43.84 48.89,44.77 48.89,48.29 51.43,50.83 53.98,50.83 57.02,53.88 86.36,53.88 87.12,53.12 87.12,50.58 88.14,49.56 89.79,49.56 JP11.16 JP8.16
IO1  (via drill 0.35)
  Top 0.508: v83.06,35.21 83.06,36.1 v83.84,36.88
  Bottom 0.508: v83.06,35.21 83.06,31.78 83.06,26.7 83.06,18.83 86.36,15.52 90.8,15.52 JP11.4 JP8.4 | v83.84,36.88 83.84,39.42 78.77,44.48 IM6.35
IO3  (via drill 0.35)
  Top 0.508: v82.1,35.15 82.1,36.8 v81.91,36.99
  Bottom 0.508: v81.91,36.99 77.47,41.43 IM6.34 | v82.1,35.15 82.1,34.51 82.3,34.32 82.3,17.05 86.36,12.98 89.91,12.98 89.91,12.99 90.81,12.99 JP11.3 JP8.3
LED0
  Bottom 0.508: RN1.12 43.58,39 LED0.A
LED1
  Bottom 0.508: RN1.11 38.03,38.2 LED1.A
LED2
  Bottom 0.508: RN1.10 36.29,37.4 34.29,39.4 30.48,39.4 LED2.A
LED3
  Bottom 0.508: RN1.9 35.82,36.6 33.73,38.69 28.92,38.69 26.98,40.63 24.33,40.63 23.01,41.94 LED3.A
M1A
  Top 2.54: IM10.OUT1 15.02,30.51 16.41,31.89 16.41,34.07 13.59,36.88 13.59,40.8 | X1.2 16.26,43.46 13.59,40.8 | JP13.1 13.46,40.67 13.59,40.8
M1B
  Bottom 2.54: IM10.OUT2 JP13.6 8.47,27.97 5.95,30.5 5.95,45.6 11.18,50.83 X1.1
M2A
  Top 2.54: IM10.OUT3 JP15.1 8.73,25.43 7.75,24.45 7.75,11.59 10.16,9.17 X2.1
M2B
  Bottom 2.54: IM10.OUT4 15.24,22.89 16.51,21.62 16.51,12.1 | X2.2 16.51,7.01 16.51,12.1 | JP15.6 15.88,12.73 16.51,12.1
N$1
  Bottom 0.508: JP30.1 IM10.ULT
N$2
  Top 0.508: 70.36,25.43 R10.2 70.36,27.97 69.34,28.99 JP2.1
N$3
  Bottom 2.54: J2.2 JP14.2
N$4
  Top 0.508: R9.2 70.36,10.95 70.29,11.02 R11.2 70.29,22.06 70.36,22.13 R10.1
OFF
  Top 0.508: R1.1 45.15,14.06 JP6.1 | IM6.13 48.64,21.62 48.64,25.81 R2.2 | SW5.4 SW5.3
  Bottom 0.508: Q6.1 40.19,6.38 42.98,9.16 SW5.4 43.1,9.53 43.38,9.81 43.38,13.06 44.7,14.38 JP6.1 48,14.51 C2.1 48.13,17.68 IM6.13
PWM0  (via drill 0.35)
  Top 0.508: v59.69,19.08 54.61,19.08 53.25,17.72 50.8,17.72 47.25,17.72 46.93,18.04 40.54,18.04 v39.62,18.95
  Bottom 0.508: IM6.25 v59.69,19.08 | IM10.IN1 31.75,20.35 32.77,19.33 34.24,17.86 37.33,17.86 38.42,18.95 v39.62,18.95
PWM1  (via drill 0.35)
  Top 0.508: IM10.IN2 35.56,16.54 35.56,14 35.62,13.94 35.62,13.84 37.53,11.92 37.53,11.16 40.5,8.19 49.98,8.19 50.7,8.9 50.7,10.35 55.08,10.35 58.73,14 v63.5,14 | v66.93,14 66.93,25.05 v68.58,26.7
  Bottom 0.508: v63.5,14 v66.93,14 | v68.58,26.7 IM6.28
PWM2  (via drill 0.35)
  Top 0.508: v78.74,3.84 79.76,4.86 79.76,16.79 78.74,17.81 76.2,17.81 74.68,19.33 74.68,27.72 76.2,29.24 IM6.29
  Bottom 0.508: v78.74,3.84 73.66,3.84 72.06,2.24 23.16,2.24 19.23,6.17 19.23,26.4 23.8,30.96 28.76,30.96 IM10.IN3
PWM3  (via drill 0.35)
  Top 0.508: v33.02,29.24 IM10.IN4
  Bottom 0.508: IM6.27 61.21,24.16 57.5,27.88 51.6,27.88 50.28,26.56 50.28,24.88 48.35,22.94 40.25,22.94 37.33,25.87 36.33,25.87 35.61,26.58 35.61,26.65 v33.02,29.24
SERVO_STEPDOWN_5V
  Top 1.27: J2.3 45.72,29.24 43.05,31.91 | JP12.2 43.05,31.91 | IM4.OUT 37.08,31.91 43.05,31.91
SLEEP  (via drill 0.35)
  Top 0.508: IM6.24 78.74,15.27 78.74,13.49 77.98,12.73 76.2,12.73 74.3,10.83 v74.3,2.95
  Bottom 0.508: v74.3,2.95 72.75,1.41 22.75,1.41 18.52,5.64 18.52,22.05 15.69,24.87 15.69,31.33 IM10.!SLEEP
START_BUTTON1
  Top 0.508: JP3.1 41.84,14.19 R4.2 39.5,15.4 38.71,16.18 38.71,19.08 38.71,19.74 SW4.4 SW4.3
  Bottom 0.508: JP3.1 39.63,14.51 C1.2
START_GATE1  (via drill 0.35)
  Top 0.508: v40.89,13.11 40.07,12.29 R4.1 | v29.08,10.57 26.67,10.57 Q2.1
  Bottom 0.508: Q2.1 24.13,17.43 24.51,17.81 R3.2 | C1.1 39.62,11.84 | 39.62,11.84 v40.89,13.11 | 39.07,7.65 Q6.3 | Q6.3 39.24,9.56 39.62,9.94 39.62,11.84 | Q6.3 36.18,7.48 36.06,7.6 32.06,7.6 v29.08,10.57
STEP2_EN1
  Top 0.508: IM4.EN JP10.1
SW0
  Top 0.508: 27.94,43.13 27.37,43.13 26.03,41.79 JP4.8 | 27.94,43.13 | 27.94,43.13 29.63,43.13 34.4,47.89 36.09,47.89 37.08,48.88 37.08,48.92 39.37,51.21 42.29,51.21 43.2,50.3 SW0.4
  Bottom 0.508: 44.2,51.85 44.2,52.99 C5.2 44.2,53.25 44.2,55.38 SW0.3 | SW0.4 44.07,50.72 44.2,50.85 44.2,51.85 | 44.2,51.85 44.2,50.58 45.84,48.94 45.84,44.74 44.82,43.72 RN1.16
SW1
  Top 0.508: JP4.6 23.62,39.53 23.62,42.7 24.13,43.21 25.53,43.21 26.83,44.51 26.83,46.21 28.5,47.89 32.89,47.89 33.39,47.89 35.37,49.86 SW1.4
  Bottom 0.508: SW1.4 36.44,50.72 | 36.44,50.72 36.45,50.72 C3.2 36.45,55.51 SW1.3 | 36.44,50.72 39.27,47.89 42.69,47.89 43.81,46.77 43.81,41.86 44.28,41.4 RN1.15
SW2
  Top 0.406: 22.86,45.88 24.89,47.91 26.01,47.91 SW2.4
  Top 0.508: 22.86,45.88 22.86,41.3 JP4.4
  Bottom 0.508: SW2.4 28.83,50.72 | 28.83,50.72 C4.2 28.83,55.51 SW2.3 | 28.83,50.72 31.64,47.91 37.72,47.91 38.45,47.18 42.4,47.18 43.11,46.47 43.11,41.57 44.08,40.6 RN1.14
SW3
  Bottom 0.508: RN1.13 43.78,39.8 43.68,39.9 41.91,41.67 41.91,42.57 41.27,43.21 30.48,43.21 29.05,44.64 29.05,44.94 28.4,45.59 20.32,45.59 | JP4.2 18.41,44.61 19.4,45.59 20.32,45.59 | SW3.3 21.21,55.51 C8.2 21.21,50.72 SW3.4 20.32,49.84 20.32,45.59
VCC  (via drill 0.35)  (1 unrouted)
  Top 0.508: D3.C 33.78,26.7 33.78,27.08
  Top 0.813: 26.92,25.43 IM10.VCC
  Top 1.016: R9.1 70.23,7.84 70.36,7.72 70.36,5.49 68.73,3.87 63.5,3.87 v63.5,3.84
  Top 2.54: 26.67,25.43 Q2.2 | 26.67,25.43 IM10.VCC 32.13,25.43 33.78,27.08 IM4.IN 40.39,27.08 J2.1 | 26.67,25.43 26.67,29.24 | 26.67,29.24 26.67,31.85 24.67,33.85 | C6.+ 26.67,29.24
  Bottom 0.813: 78.74,10.28 78.07,10.28 77.99,10.2 76.95,10.2 76.87,10.28 76.72,10.28
  Bottom 1.016: IM3.IN 86.87,5.62 85.54,6.94 83.53,6.94 80.19,10.28 78.74,10.28 78.19,10.28 | 76.72,10.28 63.37,10.28 56.93,3.84 | Q2.2 26.67,11.33 34.54,3.46 56.55,3.46 56.93,3.84 | v63.5,3.84 56.93,3.84

### Text on the board
tPlace: IN | EN
tNames: 39 | 36 | 35 | 34 | 33 | 32 | 27 | 26 | 25 | 23 | 22 | 21 | 1 | 3 | 14 | 13 | - | +
_tNames: IO15 | GND | GPIO15 | GPIO13 | M1 | IO14 | - | 3V | GREEN | P-LED | IO13 | BLUE | RED | 5V | 3.3V | GND | MA1 | GND | V5 | IO33 | Battery | GND | ENC_A1 | SW3 | SW2 | SW1 | SW0 | IO32 | ENC_B1 | PWM3 | SLEEP | ServoS-5V | GND | PWM2 | OUT1 | S-leds | MB1 | GND | GND | OUT2 | MA2 | VCC | VCC | OUT3 | S-servo | 5V | PWM1 | EN | S-servo | OUT4 | ENC_B2 | PWM0 | ULT | EN | ENC_A2 | ON | TX | ULT | GND | RX | MB2 | S-leds | M2 | OFF | - | + | 5V | - | + | RB3202-SchoolBot / v0.1